# Altium project MB1219.PrjPCB (part 3 of 3)

## Sheet MCU.SchDoc: MCU
size A3; DocumentNumber: MB1219; Revision: B.1; SheetNumber: 2; SheetTotal: 17; Project: STM32F769I-EVAL
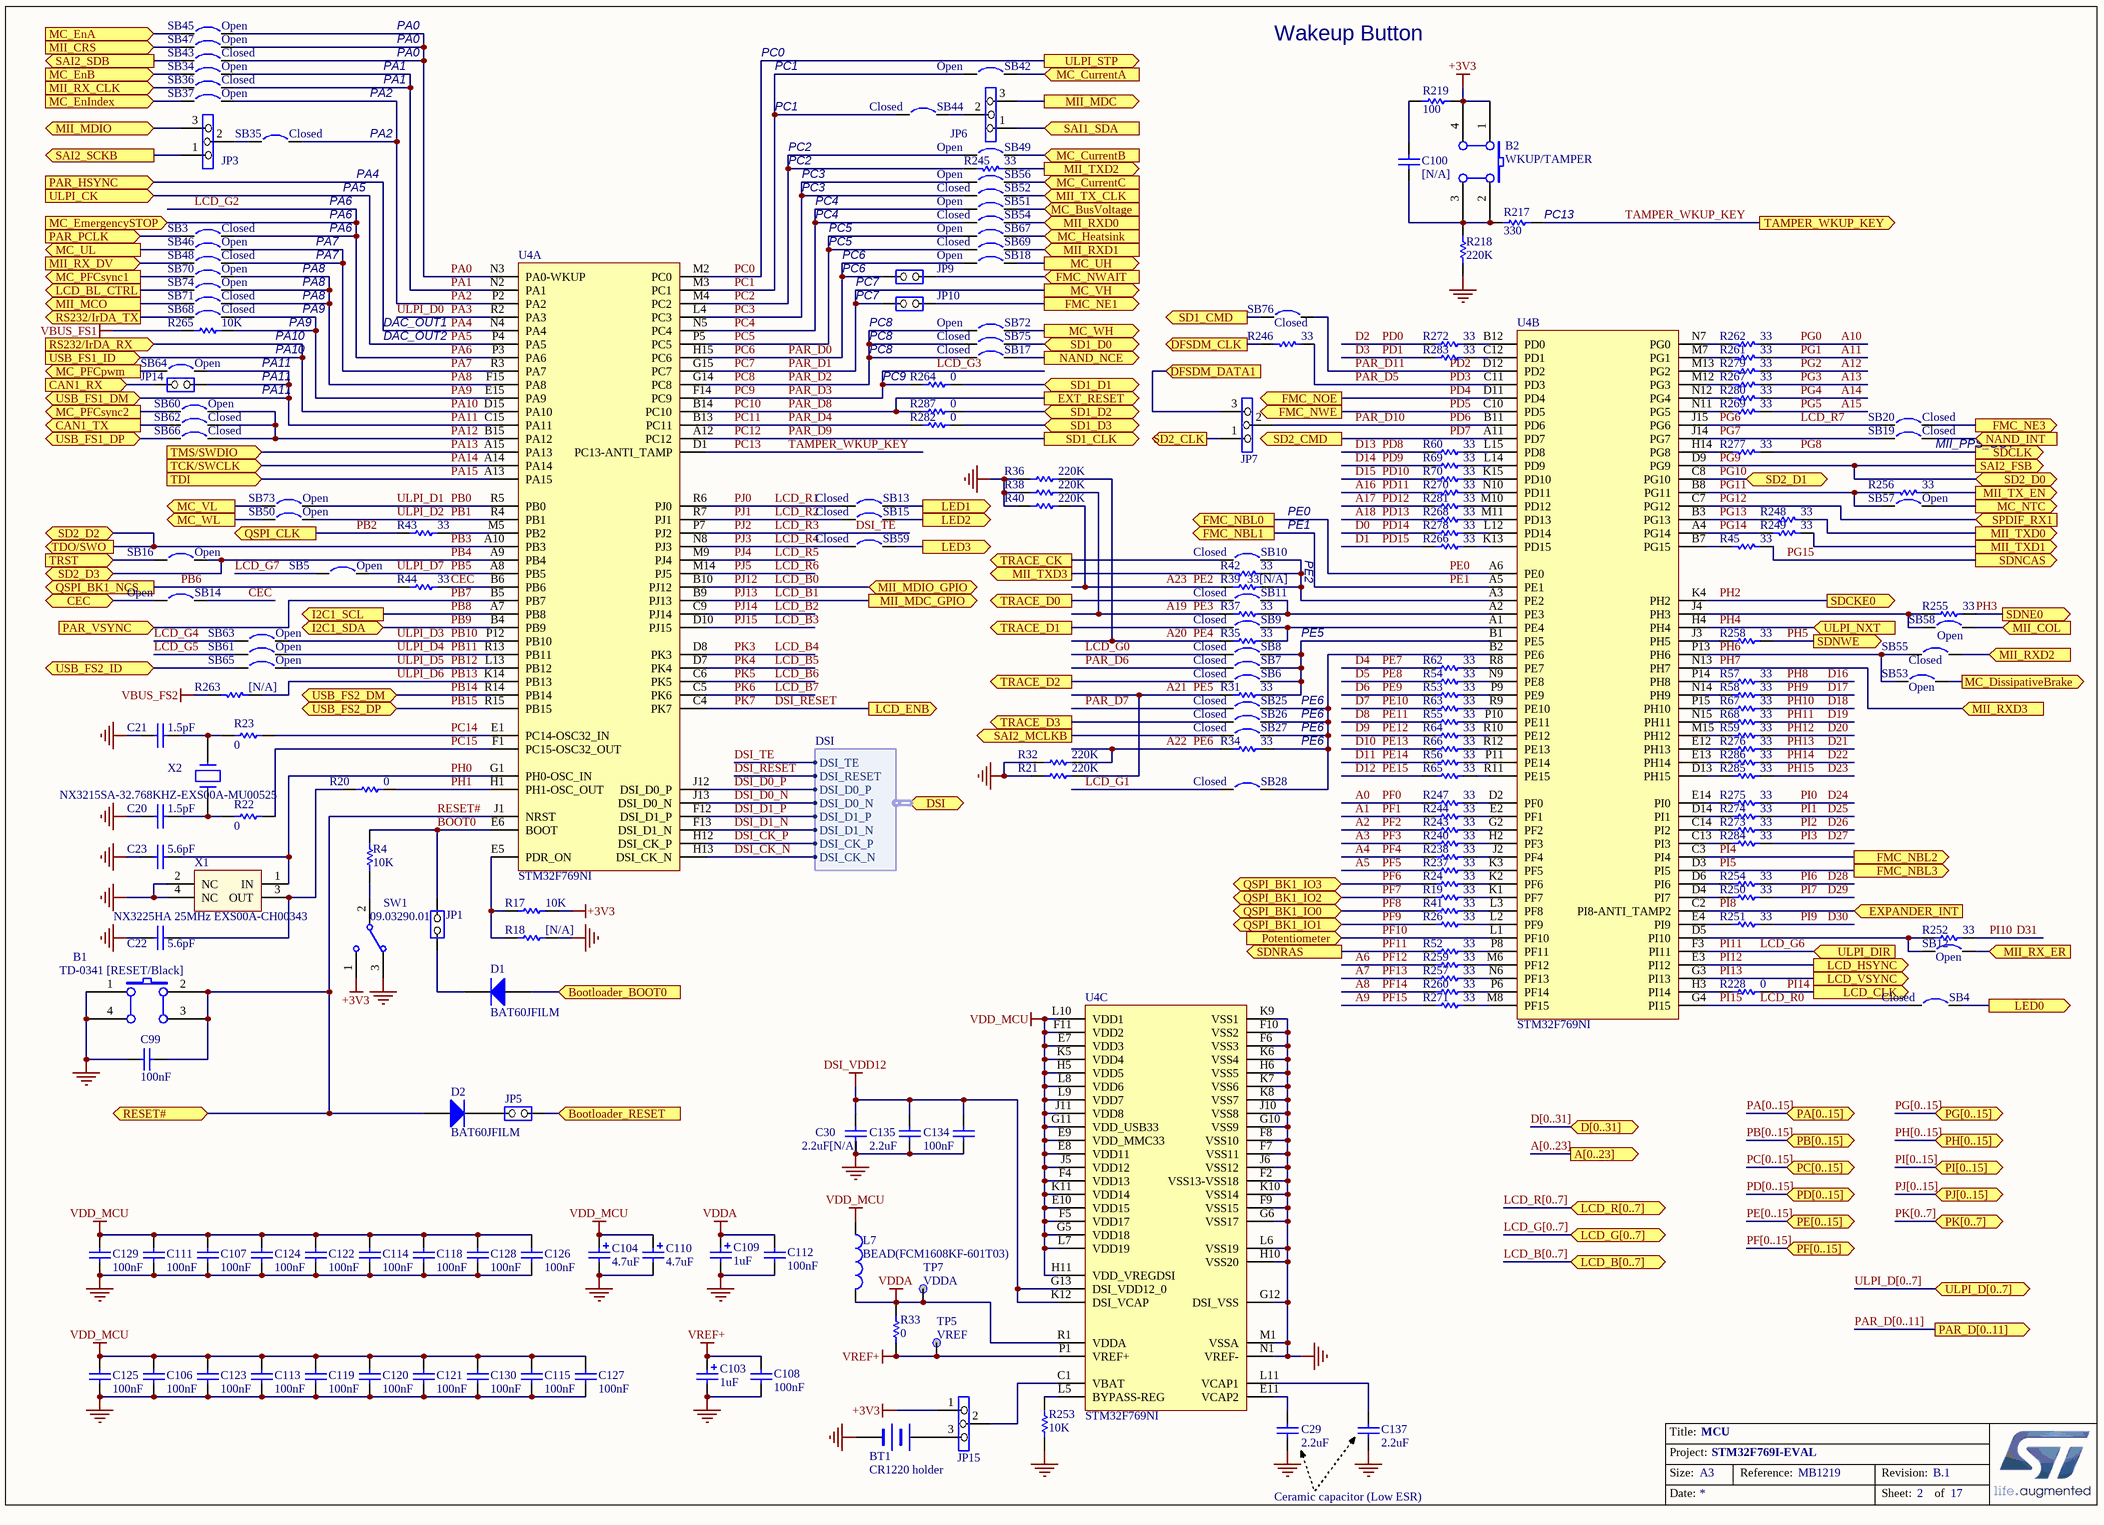
[diagram p16: MCU.SchDoc]

### Parts
B1  TD-0341 [RESET/Black]  [PB10]
B2  WKUP/TAMPER  [PB10]
BT1  CR1220 holder  [BAT_2SM_CR1220]
C20  1.5pF  [0402C]
C21  1.5pF  [0402C]
C22  5.6pF  [0603C]
C23  5.6pF  [0603C]
C29  2.2uF  [1206C]
C30  2.2uF[N/A]  [1206C]
C99  100nF  [0603C]
C100  [N/A]  [0603C]
C103  1uF  [TAN-A]
C104  4.7uF  [TAN-A]
C106  100nF  [0402C]
C107  100nF  [0402C]
C108  100nF  [0402C]
C109  1uF  [TAN-A]
C110  4.7uF  [TAN-A]
C111  100nF  [0402C]
C112  100nF  [0402C]
C113  100nF  [0402C]
C114  100nF  [0402C]
C115  100nF  [0402C]
C118  100nF  [0402C]
C119  100nF  [0402C]
C120  100nF  [0402C]
C121  100nF  [0402C]
C122  100nF  [0402C]
C123  100nF  [0402C]
C124  100nF  [0402C]
C125  100nF  [0402C]
C126  100nF  [0402C]
C127  100nF  [0402C]
C128  100nF  [0402C]
C129  100nF  [0402C]
C130  100nF  [0402C]
C134  100nF  [0402C]
C135  2.2uF  [0402C]
C137  2.2uF  [1206C]
D1  BAT60JFILM  [SOD-323]
D2  BAT60JFILM  [SOD-323]
JP1  (no value)  [SIP2]
JP3  (no value)  [SIP3]
JP5  (no value)  [SIP2]
JP6  (no value)  [SIP3]
JP7  (no value)  [SIP3]
JP9  (no value)  [SIP2]
JP10  (no value)  [SIP2]
JP14  (no value)  [SIP2]
JP15  (no value)  [SIP3]
L7  BEAD(FCM1608KF-601T03)  [0603L]
R4  10K  [0603R]
R17  10K  [0603R]
R18  [N/A]  [0603R]
R19  33  [0402R]
R20  0  [0603R]
R21  220K  [0603R]
R22  0  [0402R]
R23  0  [0402R]
R24  33  [0402R]
R26  33  [0402R]
R31  33  [0402R]
R32  220K  [0603R]
R33  0  [0603R]
R34  33  [0402R]
R35  33  [0402R]
R36  220K  [0603R]
R37  33  [0402R]
R38  220K  [0603R]
R39  33[N/A]  [0402R]
R40  220K  [0603R]
R41  33  [0402R]
R42  33  [0603R]
R43  33  [0402R]
R44  33  [0402R]
R45  33  [0402R]
R52  33  [0402R]
R53  33  [0402R]
R54  33  [0402R]
R55  33  [0402R]
R56  33  [0402R]
R57  33  [0402R]
R58  33  [0402R]
R59  33  [0402R]
R60  33  [0402R]
R62  33  [0402R]
R63  33  [0402R]
R64  33  [0402R]
R65  33  [0402R]
R66  33  [0402R]
R67  33  [0402R]
R68  33  [0402R]
R69  33  [0402R]
R70  33  [0402R]
R217  330  [0603R]
R218  220K  [0603R]
R219  100  [0603R]
R228  0  [0603R]
R237  33  [0402R]
R238  33  [0402R]
R240  33  [0402R]
R243  33  [0402R]
R244  33  [0402R]
R245  33  [0603R]
R246  33  [0603R]
R247  33  [0402R]
R248  33  [0603R]
R249  33  [0603R]
R250  33  [0402R]
R251  33  [0402R]
R252  33  [0402R]
R253  10K  [0603R]
R254  33  [0402R]
R255  33  [0402R]
R256  33  [0603R]
R257  33  [0402R]
R258  33  [0402R]
R259  33  [0402R]
R260  33  [0402R]
R261  33  [0402R]
R262  33  [0402R]
R263  [N/A]  [0603R]
R264  0  [0603R]
R265  10K  [0603R]
R266  33  [0402R]
R267  33  [0402R]
R268  33  [0402R]
R269  33  [0402R]
R270  33  [0402R]
R271  33  [0402R]
R272  33  [0402R]
R273  33  [0402R]
R274  33  [0402R]
R275  33  [0402R]
R276  33  [0402R]
R277  33  [0402R]
R278  33  [0402R]
R279  33  [0402R]
R280  33  [0402R]
R281  33  [0402R]
R282  0  [0603R]
R283  33  [0402R]
R284  33  [0402R]
R285  33  [0402R]
R286  33  [0402R]
R287  0  [0603R]
SB3  Closed  [SB_0603]
SB4  Closed  [SB_0603]
SB5  Open  [SB_0603]
SB6  Closed  [SB_0603]
SB7  Closed  [SB_0603]
SB8  Closed  [SB_0603]
SB9  Closed  [SB_0603]
SB10  Closed  [SB_0603]
SB11  Closed  [SB_0603]
SB12  Open  [SB_0603]
SB13  Closed  [SB_0603]
SB14  Open  [SB_0603]
SB15  Closed  [SB_0603]
SB16  Open  [SB_0603]
SB17  Closed  [SB_0603]
SB18  Open  [SB_0603]
SB19  Closed  [SB_0603]
SB20  Closed  [SB_0603]
SB25  Closed  [SB_0603]
SB26  Closed  [SB_0603]
SB27  Closed  [SB_0603]
SB28  Closed  [SB_0603]
SB34  Open  [SB_0603]
SB35  Closed  [SB_0603]
SB36  Closed  [SB_0603]
SB37  Open  [SB_0603]
SB42  Open  [SB_0603]
SB43  Closed  [SB_0603]
SB44  Closed  [SB_0603]
SB45  Open  [SB_0603]
SB46  Open  [SB_0603]
SB47  Open  [SB_0603]
SB48  Closed  [SB_0603]
SB49  Open  [SB_0603]
SB50  Open  [SB_0603]
SB51  Open  [SB_0603]
SB52  Closed  [SB_0603]
SB53  Open  [SB_0603]
SB54  Closed  [SB_0603]
SB55  Closed  [SB_0603]
SB56  Open  [SB_0603]
SB57  Open  [SB_0603]
SB58  Open  [SB_0603]
SB59  Closed  [SB_0603]
SB60  Open  [SB_0603]
SB61  Open  [SB_0603]
SB62  Closed  [SB_0603]
SB63  Open  [SB_0603]
SB64  Open  [SB_0603]
SB65  Open  [SB_0603]
SB66  Closed  [SB_0603]
SB67  Open  [SB_0603]
SB68  Closed  [SB_0603]
SB69  Closed  [SB_0603]
SB70  Open  [SB_0603]
SB71  Closed  [SB_0603]
SB72  Open  [SB_0603]
SB73  Open  [SB_0603]
SB74  Open  [SB_0603]
SB75  Closed  [SB_0603]
SB76  Closed  [SB_0603]
SW1  09.03290.01  [SW1_3TH_2R54_10X2R5]
TP5  VREF  [TP]
TP7  VDDA  [TP]
U4  STM32F769NI  [BGA216_0R8_13X13_SKT]  (parts A,B,C of 3)
X1  NX3225HA 25MHz EXS00A-CH00343  [XTAL_4SM_3R2X2R5]
X2  NX3215SA-32.768KHZ-EXS00A-MU00525  [XTAL_2SM_3R2X1R5]

### Ports
A[0..23] (out), Bootloader_BOOT0 (in), Bootloader_RESET (in), CAN1_RX (in), CAN1_TX (out), CEC (bidir), D[0..31] (bidir), DFSDM_CLK (out), DFSDM_DATA1 (in), DSI (harness DSI), EXPANDER_INT (in), EXT_RESET (out), FMC_NBL0 (out), FMC_NBL1 (out), FMC_NBL2 (out), FMC_NBL3 (out), FMC_NE1 (out), FMC_NE3 (out), FMC_NOE (out), FMC_NWAIT (in), FMC_NWE (out), I2C1_SCL (out), I2C1_SDA (bidir), LCD_B[0..7] (bidir), LCD_BL_CTRL (out), LCD_CLK (out), LCD_ENB (out), LCD_G[0..7] (bidir), LCD_HSYNC (out), LCD_R[0..7] (bidir), LCD_VSYNC (out), LED0 (out), LED1 (out), LED2 (out), LED3 (out), MC_BusVoltage (in), MC_CurrentA (in), MC_CurrentB (in), MC_CurrentC (in), MC_DissipativeBrake (out), MC_EmergencySTOP (in), MC_EnA (in), MC_EnB (in), MC_EnIndex (in), MC_Heatsink (in), MC_NTC (out), MC_PFCpwm (out), MC_PFCsync1 (out), MC_PFCsync2 (out), MC_UH (out), MC_UL (out), MC_VH (out), MC_VL (out), MC_WH (out), MC_WL (out), MII_COL (in), MII_CRS (in), MII_MCO (out), MII_MDC (out), MII_MDC_GPIO (out), MII_MDIO (bidir), MII_MDIO_GPIO (bidir), MII_RX_CLK (in), MII_RX_DV (in), MII_RX_ER (in), MII_RXD0 (in), MII_RXD1 (in), MII_RXD2 (in), MII_RXD3 (in), MII_TX_CLK (in), MII_TX_EN (out), MII_TXD0 (out), MII_TXD1 (out), MII_TXD2 (out), MII_TXD3 (out), NAND_INT (in), NAND_NCE (out), PA[0..15] (bidir), PAR_D[0..11] (out), PAR_HSYNC (in), PAR_PCLK (in), PAR_VSYNC (in), PB[0..15] (bidir), PC[0..15] (bidir), PD[0..15] (bidir), PE[0..15] (bidir), PF[0..15] (bidir), PG[0..15] (bidir), PH[0..15] (bidir), PI[0..15] (bidir), PJ[0..15] (bidir), PK[0..7] (bidir), Potentiometer (in), QSPI_BK1_IO0 (bidir), QSPI_BK1_IO1 (bidir), QSPI_BK1_IO2 (bidir), QSPI_BK1_IO3 (bidir), QSPI_BK1_NCS (out), QSPI_CLK (out), RESET# (bidir), RS232/IrDA_RX (in), RS232/IrDA_TX (out), SAI1_SDA (in), SAI2_FSB (out), SAI2_MCLKB (out), SAI2_SCKB (out), SAI2_SDB (out), SD1_CLK (out), SD1_CMD (out), SD1_D0 (bidir), SD1_D1 (bidir), SD1_D2 (bidir), SD1_D3 (bidir), SD2_CLK (out), SD2_CMD (out), SD2_D0 (bidir), SD2_D1 (bidir), SD2_D2 (bidir), SD2_D3 (bidir), SDCKE0 (out), SDCLK (out), SDNCAS (out), SDNE0 (out), SDNRAS (out), SDNWE (out), SPDIF_RX1 (in), TAMPER_WKUP_KEY (out), TCK/SWCLK (in), TDI (in), TDO/SWO (out), TMS/SWDIO (in), TRACE_CK (out), TRACE_D0 (out), TRACE_D1 (out), TRACE_D2 (out), TRACE_D3 (out), TRST (in), ULPI_CK (in), ULPI_D[0..7] (bidir), ULPI_DIR (in), ULPI_NXT (in), ULPI_STP (out), USB_FS1_DM (bidir), USB_FS1_DP (bidir), USB_FS1_ID (in), USB_FS2_DM (bidir), USB_FS2_DP (bidir), USB_FS2_ID (bidir)

### Harnesses
DSI: DSI_CK_P, DSI_CK_N, DSI_D0_P, DSI_D0_N, DSI_D1_P, DSI_D1_N, DSI_TE, DSI_RESET

### Nets
+3V3: B2.1(A0) B2.4(A1) JP15.1 R17.2 R219.1 SW1.1
DSI_VDD12: C30.1 C134.1 C135.1 U4.G13(DSI_VDD12_0) U4.K12(DSI_VCAP)
GND: B1.1(A0) B1.4(A1) BT1.2(-) C20.2 C21.2 C22.2 C23.2 C29.2 C30.2 C99.1 C103.2 C104.2 C106.2 C107.2 C108.1 C109.2 C110.2 C111.2 C112.1 C113.2 C114.2 C115.2 C118.2 C119.2 C120.2 C121.2 C122.2 C123.2 C124.2 C125.2 C126.2 C127.2 C128.2 C129.2 C130.2 C134.2 C135.2 C137.2 R18.2 R21.1 R32.1 R36.1 R38.1 R40.1 R218.2 R253.1 SW1.3 U4.F2(VSS13-VSS18) U4.F6(VSS3) U4.F7(VSS11) U4.F8(VSS10) U4.F9(VSS15) U4.F10(VSS2) U4.G6(VSS17) U4.G10(VSS9) U4.G12(DSI_VSS) U4.H6(VSS5) U4.H10(VSS20) U4.J6(VSS12) U4.J10(VSS8) U4.K6(VSS4) U4.K7(VSS6) U4.K8(VSS7) U4.K9(VSS1) U4.K10(VSS14) U4.L6(VSS19) U4.M1(VSSA) U4.N1(VREF-) X1.2(NC) X1.4(NC)
VBUS_FS1: R265.2
VBUS_FS2: R263.1
VDD_MCU: C104.1 C106.1 C107.1 C110.1 C111.1 C113.1 C114.1 C115.1 C118.1 C119.1 C120.1 C121.1 C122.1 C123.1 C124.1 C125.1 C126.1 C127.1 C128.1 C129.1 C130.1 L7.1 U4.E7(VDD3) U4.E8(VDD11) U4.E9(VDD_MMC33) U4.E10(VDD15) U4.F4(VDD13) U4.F5(VDD17) U4.F11(VDD2) U4.G5(VDD18) U4.G11(VDD_USB33) U4.H5(VDD5) U4.H11(VDD_VREGDSI) U4.J5(VDD12) U4.J11(VDD8) U4.K5(VDD4) U4.K11(VDD14) U4.L7(VDD19) U4.L8(VDD6) U4.L9(VDD7) U4.L10(VDD1)
VDDA: C109.1 C112.2 L7.2 R33.1 TP7.1 U4.R1(VDDA)
VREF+: C103.1 C108.2 R33.2 TP5.1 U4.P1(VREF+)
A0: R247.2  [also labelled PF0]
A1: R244.2  [also labelled PF1]
A2: R243.2  [also labelled PF2]
A3: R240.2  [also labelled PF3]
A4: R238.2  [also labelled PF4]
A5: R237.2  [also labelled PF5]
A6: R259.2  [also labelled PF12]
A7: R257.2  [also labelled PF13]
A8: R260.2  [also labelled PF14]
A9: R271.2  [also labelled PF15]
A10: R262.2  [also labelled PG0]
A11: R261.2  [also labelled PG1]
A12: R279.2  [also labelled PG2]
A13: R267.2  [also labelled PG3]
A14: R280.2  [also labelled PG4]
A15: R269.2  [also labelled PG5]
A16: R270.1  [also labelled PD11]
A17: R281.2  [also labelled PD12]
A18: R268.2  [also labelled PD13]
A19: R37.2 R38.2  [also labelled PE3]
A20: R35.2 R36.2  [also labelled PE4]
A21: R21.2 R31.2  [also labelled PE5]
A22: R32.2 R34.2  [also labelled PE6]
A23: R39.2 R40.2  [also labelled PE2]
BOOT0: JP1.2(NO) R4.1 U4.E6(BOOT)
CEC: R44.1 SB14.2 U4.B6(PB6)
D0: R278.2  [also labelled PD14]
D1: R266.2  [also labelled PD15]
D2: R272.2  [also labelled PD0]
D2_P: SB66.1 ; port USB_FS1_DP
D3: R283.2  [also labelled PD1]
D4: R62.2  [also labelled PE7]
D5: R54.2  [also labelled PE8]
D6: R53.2  [also labelled PE9]
D7: R63.2  [also labelled PE10]
D8: R55.2  [also labelled PE11]
D9: R64.2  [also labelled PE12]
D10: R66.2  [also labelled PE13]
D11: R56.2  [also labelled PE14]
D12: R65.2  [also labelled PE15]
D13: R60.2  [also labelled PD8]
D14: R69.2  [also labelled PD9]
D15: R70.2  [also labelled PD10]
D16: R57.1  [also labelled PH8]
D17: R58.1  [also labelled PH9]
D18: R67.1  [also labelled PH10]
D19: R68.1  [also labelled PH11]
D20: R59.1  [also labelled PH12]
D21: R276.1  [also labelled PH13]
D22: R286.1  [also labelled PH14]
D23: R285.1  [also labelled PH15]
D24: R275.1  [also labelled PI0]
D25: R274.1  [also labelled PI1]
D26: R273.1  [also labelled PI2]
D27: R284.1  [also labelled PI3]
D28: R254.1  [also labelled PI6]
D29: R250.1  [also labelled PI7]
D30: R251.1  [also labelled PI9]
D31: R252.1  [also labelled PI10]
DSI_CK_N: U4.H13(DSI_CK_N) ; port DSI.DSI_CK_N
DSI_CK_P: U4.H12(DSI_CK_P) ; port DSI.DSI_CK_P
DSI_D0_N: U4.J13(DSI_D0_N) ; port DSI.DSI_D0_N
DSI_D0_P: U4.J12(DSI_D0_P) ; port DSI.DSI_D0_P
DSI_D1_N: U4.F13(DSI_D1_N) ; port DSI.DSI_D1_N
DSI_D1_P: U4.F12(DSI_D1_P) ; port DSI.DSI_D1_P
DSI_RESET: U4.C4(PK7) ; port LCD_ENB, port DSI.DSI_RESET  [also labelled PK7]
DSI_TE: U4.P7(PJ2) ; port DSI.DSI_TE  [also labelled LCD_R3, PJ2]
LCD_B0: U4.B10(PJ12) ; port MII_MDIO_GPIO  [also labelled PJ12]
LCD_B1: U4.B9(PJ13) ; port MII_MDC_GPIO  [also labelled PJ13]
LCD_B2: U4.C9(PJ14)  [also labelled PJ14]
LCD_B3: U4.D10(PJ15)  [also labelled PJ15]
LCD_B4: U4.D8(PK3)  [also labelled PK3]
LCD_B5: U4.D7(PK4)  [also labelled PK4]
LCD_B6: U4.C6(PK5)  [also labelled PK5]
LCD_B7: U4.C5(PK6)  [also labelled PK6]
LCD_BL_CTRL: SB74.1 ; port LCD_BL_CTRL
LCD_G0: SB8.1
LCD_G1: SB28.1
LCD_G2: SB3.2 U4.P3(PA6) ; port MC_EmergencySTOP  [also labelled PA6]
LCD_G3: R264.2 U4.F14(PC9)  [also labelled PAR_D3, PC9]
LCD_G4: SB63.1
LCD_G5: SB61.1
LCD_G6: U4.F3(PI11) ; port ULPI_DIR  [also labelled PI11]
LCD_G7: SB5.1
LCD_R0: SB4.1 U4.G4(PI15)  [also labelled PI15]
LCD_R1: SB13.1 U4.R6(PJ0)  [also labelled PJ0]
LCD_R2: SB15.1 U4.R7(PJ1)  [also labelled PJ1]
LCD_R4: SB59.1 U4.N8(PJ3)  [also labelled PJ3]
LCD_R5: U4.M9(PJ4)  [also labelled PJ4]
LCD_R6: U4.M14(PJ5)  [also labelled PJ5]
LCD_R7: SB20.1 U4.J15(PG6)  [also labelled PG6]
PA0: SB43.2 SB45.2 SB47.2 U4.N3(PA0-WKUP)
PA1: SB34.2 SB36.2 U4.N2(PA1)
PA2: SB35.2 SB37.2 U4.P2(PA2)
PA3: U4.R2(PA3)  [also labelled ULPI_D0]
PA4: U4.N4(PA4) ; port PAR_HSYNC
PA5: U4.P4(PA5) ; port ULPI_CK
PA7: SB46.2 SB48.2 U4.R3(PA7)
PA8: SB70.2 SB71.2 SB74.2 U4.F15(PA8)
PA9: R265.1 SB68.2 U4.E15(PA9)
PA10: U4.D15(PA10) ; port RS232/IrDA_RX, port USB_FS1_ID
PA11: JP14.1(COMMON) SB64.2 U4.C15(PA11) ; port USB_FS1_DM  [project net D2_N]
PA12: SB60.2 SB62.2 SB66.2 U4.B15(PA12)
PA13: U4.A15(PA13) ; port TMS/SWDIO
PA14: U4.A14(PA14) ; port TCK/SWCLK
PA15: U4.A13(PA15) ; port TDI
PAR_D0: JP9.1(COMMON) SB18.1 U4.H15(PC6)  [also labelled PC6]
PAR_D1: JP10.1(COMMON) U4.G15(PC7) ; port MC_VH  [also labelled PC7]
PAR_D2: SB17.1 SB72.1 SB75.1 U4.G14(PC8)  [also labelled PC8]
PAR_D4: R282.2 U4.B13(PC11)  [also labelled PC11]
PAR_D5: R246.2 U4.C11(PD3)  [also labelled PD3]
PAR_D6: SB7.1
PAR_D7: SB25.1
PAR_D8: R287.2 U4.B14(PC10) ; port EXT_RESET  [also labelled PC10]
PAR_D9: U4.A12(PC12) ; port SD1_CLK  [also labelled PC12]
PAR_D10: JP7.2 U4.B11(PD6)  [also labelled PD6]
PAR_D11: SB76.2 U4.D12(PD2)  [also labelled PD2]
PB0: SB73.2 U4.R5(PB0)  [also labelled ULPI_D1]
PB1: SB50.2 U4.R4(PB1)  [also labelled ULPI_D2]
PB2: R43.2 ; port QSPI_CLK
PB3: U4.A10(PB3) ; port TDO/SWO, port SD2_D2
PB4: SB16.2 U4.A9(PB4) ; port SD2_D3
PB5: SB5.2 U4.A8(PB5)  [also labelled ULPI_D7]
PB6: R44.2 ; port QSPI_BK1_NCS
PB7: U4.B5(PB7) ; port PAR_VSYNC
PB8: U4.A7(PB8) ; port I2C1_SCL  [project net I2C1_SCL]
PB9: U4.B4(PB9) ; port I2C1_SDA  [project net I2C1_SDA]
PB10: SB63.2 U4.P12(PB10)  [also labelled ULPI_D3]
PB11: SB61.2 U4.R13(PB11)  [also labelled ULPI_D4]
PB12: SB65.2 U4.L13(PB12)  [also labelled ULPI_D5]
PB13: R263.2 U4.K14(PB13)  [also labelled ULPI_D6]
PB14: U4.R14(PB14) ; port USB_FS2_DM  [project net D1_N]
PB15: U4.R15(PB15) ; port USB_FS2_DP  [project net D1_P]
PC0: U4.M2(PC0) ; port ULPI_STP
PC1: SB42.1 SB44.1 U4.M3(PC1)
PC2: R245.1 SB49.1 U4.M4(PC2)
PC3: SB52.1 SB56.1 U4.L4(PC3)
PC4: SB51.1 SB54.1 U4.N5(PC4)
PC5: SB67.1 SB69.1 U4.P5(PC5)
PC13: R217.2 U4.D1(PC13-ANTI_TAMP) ; port TAMPER_WKUP_KEY  [also labelled TAMPER_WKUP_KEY]
PC14: R23.2 U4.E1(PC14-OSC32_IN)
PC15: R22.2 U4.F1(PC15-OSC32_OUT)
PD4: U4.D11(PD4) ; port FMC_NOE
PD5: U4.C10(PD5) ; port FMC_NWE
PD7: U4.A11(PD7) ; port SD2_CMD
PE0: U4.A6(PE0) ; port FMC_NBL0
PE1: U4.A5(PE1) ; port FMC_NBL1
PF6: R24.2 ; port QSPI_BK1_IO3
PF7: R19.2 ; port QSPI_BK1_IO2
PF8: R41.2 ; port QSPI_BK1_IO0
PF9: R26.2 ; port QSPI_BK1_IO1
PF10: U4.L1(PF10) ; port Potentiometer
PF11: R52.2 ; port SDNRAS
PG7: SB19.1 U4.J14(PG7)
PG8: R277.2 ; port SDCLK
PG9: U4.D9(PG9) ; port SAI2_FSB, port SD2_D0
PG10: U4.C8(PG10) ; port SD2_D1
PG11: R256.1 SB57.1 U4.B8(PG11)
PG12: U4.C7(PG12) ; port SPDIF_RX1
PG13: R248.1 U4.B3(PG13)
PG14: R249.1 U4.A4(PG14)
PG15: R45.2 ; port SDNCAS
PH0: C23.1 U4.G1(PH0-OSC_IN) X1.1(IN)
PH1: R20.1 U4.H1(PH1-OSC_OUT)
PH2: U4.K4(PH2) ; port SDCKE0
PH3: R255.1 ; port SDNE0
PH4: U4.H4(PH4) ; port ULPI_NXT
PH5: R258.1 ; port SDNWE
PH6: SB53.1 SB55.1 U4.P13(PH6)
PH7: U4.N13(PH7) ; port MII_RXD3
PI4: U4.C3(PI4) ; port FMC_NBL2
PI5: U4.D3(PI5) ; port FMC_NBL3
PI8: U4.C2(PI8-ANTI_TAMP2) ; port EXPANDER_INT
PI12: U4.E3(PI12) ; port LCD_HSYNC
PI13: U4.G3(PI13) ; port LCD_VSYNC
PI14: R228.1 ; port LCD_CLK
RESET#: B1.2(B0) B1.3(B1) C99.2 D2.1(A) U4.J1(NRST) ; port RESET#
T_JRST: SB16.1 ; port TRST
NetB2_2: B2.2(B0) B2.3(B1) C100.2 R217.1 R218.1
NetBT1_1: BT1.1(+) JP15.3
NetC6_2: SB45.1 ; port MC_EnA
NetC7_2: SB60.1 ; port MC_PFCsync2
NetC8_2: SB34.1 ; port MC_EnB
NetC9_2: SB37.1 ; port MC_EnIndex
NetC10_2: SB64.1 ; port MC_PFCpwm
NetC11_1: SB67.2 ; port MC_Heatsink
NetC12_2: SB56.2 ; port MC_CurrentC
NetC13_2: SB49.2 ; port MC_CurrentB
NetC14_2: SB42.2 ; port MC_CurrentA
NetC15_1: SB51.2 ; port MC_BusVoltage
NetC18_2: SB70.1 ; port MC_PFCsync1
NetC20_1: C20.1 R22.1 X2.1
NetC21_1: C21.1 R23.1 X2.2
NetC22_1: C22.1 R20.2 X1.3(OUT)
NetC29_1: C29.1 U4.E11(VCAP2)
NetC100_1: C100.1 R219.2
NetC137_1: C137.1 U4.L11(VCAP1)
NetCN1_3: SB18.2 ; port MC_UH
NetCN1_5: SB46.1 ; port MC_UL
NetCN1_9: SB73.1 ; port MC_VL
NetCN1_11: SB72.2 ; port MC_WH
NetCN1_13: SB50.1 ; port MC_WL
NetCN1_21: SB57.2 ; port MC_NTC
NetCN1_23: SB53.2 ; port MC_DissipativeBrake
NetCN4_33: SB3.1 ; port PAR_PCLK
NetCN11_6: JP9.2(NO) ; port FMC_NWAIT
NetCN12_12: SB10.1 ; port TRACE_CK
NetCN12_14: SB11.1 ; port TRACE_D0
NetCN12_16: SB9.1 ; port TRACE_D1
NetCN12_18: SB6.1 ; port TRACE_D2
NetCN12_20: SB26.1 ; port TRACE_D3
NetCN14_4: SB65.1 ; port USB_FS2_ID
NetCN15_35: JP3.1 ; port SAI2_SCKB
NetCN15_39: SB43.1 ; port SAI2_SDB
NetCN15_45: SB71.1 ; port MII_MCO
NetCN15_47: SB14.1 ; port CEC
NetCN17_1: R287.1 ; port SD1_D2
NetCN17_2: R282.1 ; port SD1_D3
NetCN17_3: SB76.1 ; port SD1_CMD
NetCN17_7: SB75.2 ; port SD1_D0
NetCN17_8: R264.1 ; port SD1_D1
NetCN30_5: JP7.1 ; port SD2_CLK
NetD1_1: D1.1(A) ; port Bootloader_BOOT0
NetD1_2: D1.2(K) JP1.1(COMMON)
NetD2_2: D2.2(K) JP5.1(COMMON)
NetJP3_2: JP3.2 SB35.1
NetJP3_3: JP3.3 ; port MII_MDIO
NetJP5_2: JP5.2(NO) ; port Bootloader_RESET
NetJP6_1: JP6.1 ; port SAI1_SDA
NetJP6_2: JP6.2 SB44.2
NetJP6_3: JP6.3 ; port MII_MDC
NetJP7_3: JP7.3 ; port DFSDM_DATA1
NetJP10_2: JP10.2(NO) ; port FMC_NE1
NetJP13_3: SB19.2 ; port NAND_INT
NetJP14_2: JP14.2(NO) ; port CAN1_RX
NetJP15_2: JP15.2 U4.C1(VBAT)
NetJP17_3: SB17.2 ; port NAND_NCE
NetJP24_3: R246.1 ; port DFSDM_CLK
NetJP26_2: SB68.1 ; port RS232/IrDA_TX
NetR4_2: R4.2 SW1.2
NetR17_1: R17.1 R18.1 U4.E5(PDR_ON)
NetR19_1: R19.1 U4.K1(PF7)
NetR24_1: R24.1 U4.K2(PF6)
NetR26_1: R26.1 U4.L2(PF9)
NetR31_1: R31.1 SB6.2 SB7.2 SB8.2 U4.B1(PE5)
NetR34_1: R34.1 SB25.2 SB26.2 SB27.2 SB28.2 U4.B2(PE6)
NetR35_1: R35.1 SB9.2 U4.A1(PE4)
NetR37_1: R37.1 SB11.2 U4.A2(PE3)
NetR39_1: R39.1 R42.2 SB10.2 U4.A3(PE2)
NetR41_1: R41.1 U4.L3(PF8)
NetR42_1: R42.1 ; port MII_TXD3
NetR43_1: R43.1 U4.M5(PB2)
NetR45_1: R45.1 U4.B7(PG15)
NetR47_2: SB55.2 ; port MII_RXD2
NetR48_2: SB69.2 ; port MII_RXD1
NetR49_2: SB54.2 ; port MII_RXD0
NetR50_2: SB48.1 ; port MII_RX_DV
NetR51_2: SB36.1 ; port MII_RX_CLK
NetR52_1: R52.1 U4.P8(PF11)
NetR53_1: R53.1 U4.P9(PE9)
NetR54_1: R54.1 U4.N9(PE8)
NetR55_1: R55.1 U4.P10(PE11)
NetR56_1: R56.1 U4.P11(PE14)
NetR57_2: R57.2 U4.P14(PH8)
NetR58_2: R58.2 U4.N14(PH9)
NetR59_2: R59.2 U4.M15(PH12)
NetR60_1: R60.1 U4.L15(PD8)
NetR61_2: SB52.2 ; port MII_TX_CLK
NetR62_1: R62.1 U4.R8(PE7)
NetR63_1: R63.1 U4.R9(PE10)
NetR64_1: R64.1 U4.R10(PE12)
NetR65_1: R65.1 U4.R11(PE15)
NetR66_1: R66.1 U4.R12(PE13)
NetR67_2: R67.2 U4.P15(PH10)
NetR68_2: R68.2 U4.N15(PH11)
NetR69_1: R69.1 U4.L14(PD9)
NetR70_1: R70.1 U4.K15(PD10)
NetR146_2: SB20.2 ; port FMC_NE3
NetR213_1: SB59.2 ; port LED3
NetR214_1: SB15.2 ; port LED2
NetR215_1: SB13.2 ; port LED1
NetR216_1: SB4.2 ; port LED0
NetR228_2: R228.2 U4.H3(PI14)
NetR237_1: R237.1 U4.K3(PF5)
NetR238_1: R238.1 U4.J2(PF4)
NetR240_1: R240.1 U4.H2(PF3)
NetR243_1: R243.1 U4.G2(PF2)
NetR244_1: R244.1 U4.E2(PF1)
NetR245_2: R245.2 ; port MII_TXD2
NetR247_1: R247.1 U4.D2(PF0)
NetR248_2: R248.2 ; port MII_TXD0
NetR249_2: R249.2 ; port MII_TXD1
NetR250_2: R250.2 U4.D4(PI7)
NetR251_2: R251.2 U4.E4(PI9)
NetR252_2: R252.2 SB12.1 U4.D5(PI10)
NetR253_2: R253.2 U4.L5(BYPASS-REG)
NetR254_2: R254.2 U4.D6(PI6)
NetR255_2: R255.2 SB58.1 U4.J4(PH3)
NetR256_2: R256.2 ; port MII_TX_EN
NetR257_1: R257.1 U4.N6(PF13)
NetR258_2: R258.2 U4.J3(PH5)
NetR259_1: R259.1 U4.M6(PF12)
NetR260_1: R260.1 U4.P6(PF14)
NetR261_1: R261.1 U4.M7(PG1)
NetR262_1: R262.1 U4.N7(PG0)
NetR266_1: R266.1 U4.K13(PD15)
NetR267_1: R267.1 U4.M12(PG3)
NetR268_1: R268.1 U4.M11(PD13)
NetR269_1: R269.1 U4.N11(PG5)
NetR270_2: R270.2 U4.N10(PD11)
NetR271_1: R271.1 U4.M8(PF15)
NetR272_1: R272.1 U4.B12(PD0)
NetR273_2: R273.2 U4.C14(PI2)
NetR274_2: R274.2 U4.D14(PI1)
NetR275_2: R275.2 U4.E14(PI0)
NetR276_2: R276.2 U4.E12(PH13)
NetR277_1: R277.1 U4.H14(PG8)
NetR278_1: R278.1 U4.L12(PD14)
NetR279_1: R279.1 U4.M13(PG2)
NetR280_1: R280.1 U4.N12(PG4)
NetR281_1: R281.1 U4.M10(PD12)
NetR283_1: R283.1 U4.C12(PD1)
NetR284_2: R284.2 U4.C13(PI3)
NetR285_2: R285.2 U4.D13(PH15)
NetR286_2: R286.2 U4.E13(PH14)
NetSB12_2: SB12.2 ; port MII_RX_ER
NetSB27_1: SB27.1 ; port SAI2_MCLKB
NetSB47_1: SB47.1 ; port MII_CRS
NetSB58_2: SB58.2 ; port MII_COL
NetSB62_1: SB62.1 ; port CAN1_TX

### Buses and harness runs
bus A[0..23] = port A[0..23]
bus D[0..31] = port D[0..31]
bus LCD_B[0..7] = port LCD_B[0..7]
bus LCD_G[0..7] = port LCD_G[0..7]
bus LCD_R[0..7] = port LCD_R[0..7]
bus PA[0..15] = port PA[0..15]
bus PAR_D[0..11] = port PAR_D[0..11]
bus PB[0..15] = port PB[0..15]
bus PC[0..15] = port PC[0..15]
bus PD[0..15] = port PD[0..15]
bus PE[0..15] = port PE[0..15]
bus PF[0..15] = port PF[0..15]
bus PG[0..15] = port PG[0..15]
bus PH[0..15] = port PH[0..15]
bus PI[0..15] = port PI[0..15]
bus PJ[0..15] = port PJ[0..15]
bus PK[0..7] = port PK[0..7]
bus ULPI_D[0..7] = port ULPI_D[0..7]

### Notes on the sheet
- PA0
- Wakeup Button
- PA2
- PA1
- PC0
- PC1
- PA4
- PC2
- PC3
- PA7
- PA6
- PA5
- PC4
- PC5
- (near R217) PC13
- PA8
- PA9
- PC6
- PC7
- PA11
- PA10
- DAC_OUT1
- DAC_OUT2
- (near JP10) PC8
- PC8
- PC9
- (near SB19) MII_PPS_OUT
- PE0
- PE1
- PE2
- PE5
- PE6
- Ceramic capacitor (Low ESR)
- Title:
- Project:
- Size:
- Date:
- A3
- Reference:
- Sheet:
- Revision:
- of

### Library data of the parts
B1 B2 = SW PUSHBUTTON: SE PUSHBUTTON
BT1 = BATTERY
C20-C23 C106 C107 C111 C113-C115 C118-C130 C134 = CAP: Capacitor
  C106 C107 C111 C113-C115 C118-C130 C134: Published: 8-Jun-2000; Revision: July-2002: Re-released for DXP Platform.; Publisher: Altium Limited; Value: 100nF
C29 C30 C108 C112 C137 = Cap: Capacitor; Value: 10nF; Published: 8-Jun-2000; Revision: July-2002: Re-released for DXP Platform.; Publisher: Altium Limited
C99 C100 = CAP: Capacitor; Value: 100pF; Published: 8-Jun-2000; Revision: July-2002: Re-released for DXP Platform.; Publisher: Altium Limited
C103 C109 = Cap Pol1: Polarized Capacitor (Radial); Value: 10uF; Published: 8-Jun-2000; Revision: July-2002: Re-released for DXP Platform.; Publisher: Altium Limited
C104 C110 = Cap Pol1: Polarized Capacitor (Radial); Value: 47uF; Published: 8-Jun-2000; Revision: July-2002: Re-released for DXP Platform.; Publisher: Altium Limited
C135 = CAP: Capacitor; Value: 100nF; Published: 8-Jun-2000; Revision: July-2002: Re-released for DXP Platform.; Publisher: Altium Limited
D1 D2 = Diode: Default Diode; Code - JEDEC: DO-214-AB; Published: 8-Jun-2000; Revision: July-2002: Re-released for DXP Platform.; Publisher: Altium Limited
JP1 JP5 JP14 = JP2
JP3 JP6 JP7 JP15 = Jumper3
JP9 JP10 = JP2: Ordered by: Subcon; Silkscreen: Pwr_ext
L7 = Inductor: Value: 100uH; Published: 8-Jun-2000; Revision: July-2002: Re-released for DXP Platform.; Publisher: Altium Limited
R4 R21 R32 R36 R38 R40 R218 R265 = res1: Resistor; Value: 1K; Published: 8-Jun-2000; Revision: July-2002: Re-released for DXP Platform.; Publisher: Altium Limited
R17-R20 R22-R24 R26 R31 R33-R35 R37 R39 R41-R45 R52-R60 R62-R70 R217 R219 R228 R237 R238 R240 R243-R264 R266-R287 = Res1: Resistor; Value: 1K; Published: 8-Jun-2000; Revision: July-2002: Re-released for DXP Platform.; Publisher: Altium Limited
SB3 SB4 SB6-SB11 SB13-SB15 SB17 SB19 SB20 SB25-SB28 SB35 SB36 SB43 SB44 SB48 SB52 SB54 SB55 SB59 SB62 SB66 SB68 SB69 SB71 SB75 SB76 = Circuit Breaker_close: Circuit Breaker; Published: 24-Mar-1999; Revision: July-2002: Re-released for DXP Platform.; Publisher: Altium Limited
SB5 SB12 SB16 SB18 SB34 SB37 SB42 SB45-SB47 SB49-SB51 SB53 SB56-SB58 SB60 SB61 SB63-SB65 SB67 SB70 SB72-SB74 = Circuit Breaker: Published: 24-Mar-1999; Revision: July-2002: Re-released for DXP Platform.; Publisher: Altium Limited
SW1 = SW-SPDT: SPDT Subminiature Toggle Switch, Right Angle Mounting, Vertical Actuation; Revision 1: Jul-2002: Re-released for DXP Platform.; Revision 2: 17-Dec-2003: Schematic revised, PCB Footprint replaced.; Published: 24-Mar-1999; Datasheet: Latest Revision: 05-Dec-2000; Publisher: Altium Limited
TP5 TP7 = TP
U4 = STM32F7_TFBGA216
X1 = NX3225HA 25MHz
X2 = CRYSTAL_32K: Crystal

## Nets that join several sheets
+1V8: Audio (6 pins), Power (C61.1 TP6.1 U19.2 U19.4), LCD&Camera&Connectors (10 pins)
+2V8: Power (5 pins), LCD&Camera&Connectors (8 pins)
+3V3: MB1219 (R160.1 R161.1), Audio (13 pins), CAN&QSPI (7 pins), Ethernet (23 pins), ExtensionConnector (CN5.48 CN6.48 CN11.40), JTAG&Trace (8 pins), Memory (45 pins), MotorControl (CN1.28 R13.2), Peripherals (21 pins), Power (7 pins), ST_LINK_V2-1 (R180.1), USB_OTG (15 pins), USB_OTG_FS (R116.2 R127.2 R131.1), RS232 (C132.1 U5.22 U5.26), LCD&Camera&Connectors (6 pins), MFX & LEDs (17 pins), MCU (6 pins)
+5V: ExtensionConnector (CN5.60 CN6.60), MotorControl (CN1.25), Power (11 pins), ST_LINK_V2-1 (D16.1), USB_OTG (U7.5), USB_OTG_FS (U11.5), LCD&Camera&Connectors (L5.1 L8.1)
D5V: ExtensionConnector (CN5.49 CN6.49), Power (JP20.7), ST_LINK_V2-1 (D6.1)
E5V: Power (C57.1 JP20.9 L3.3), ST_LINK_V2-1 (D11.1)
GND: Audio (46 pins), CAN&QSPI (12 pins), Ethernet (20 pins), ExtensionConnector (22 pins), JTAG&Trace (24 pins), Memory (40 pins), MotorControl (27 pins), Peripherals (18 pins), Power (18 pins), ST_LINK_V2-1 (40 pins), USB_OTG (39 pins), USB_OTG_FS (13 pins), RS232 (8 pins), LCD&Camera&Connectors (49 pins), MFX & LEDs (16 pins), MCU (70 pins)
U5V_ST_LINK: Power (JP20.11), ST_LINK_V2-1 (C54.2 SB33.2 U17.6 U17.7)
VBUS_FS1: ExtensionConnector (CN6.54), Power (JP20.3), ST_LINK_V2-1 (D9.1), USB_OTG_FS (5 pins), MCU (R265.2)
VBUS_FS2: Power (JP20.5), ST_LINK_V2-1 (D10.1), USB_OTG (CN14.1 D7.6 R136.1 SB22.1), MCU (R263.1)
VBUS_HS: Power (JP20.1), ST_LINK_V2-1 (D8.1), USB_OTG (CN8.1 D3.A1 L2.2)
VDD_MCU: Power (JP2.2), MCU (41 pins)
A0: ExtensionConnector (CN11.14), Memory (U9.E2 U15.G8 U16.A3), MCU (R247.2)
A1: ExtensionConnector (CN11.12), Memory (U9.D2 U15.G9 U16.A4), MCU (R244.2)
A2: ExtensionConnector (CN11.8), Memory (U9.C2 U15.F7 U16.A5), MCU (R243.2)
A3: ExtensionConnector (CN11.5), Memory (U9.A2 U15.F3 U16.B3), MCU (R240.2)
A4: ExtensionConnector (CN11.3), Memory (U9.B2 U15.G1 U16.B4), MCU (R238.2)
A5: ExtensionConnector (CN11.1), Memory (U9.D3 U15.G2 U16.C3), MCU (R237.2)
A6: ExtensionConnector (CN10.5), Memory (U9.C3 U15.G3 U16.C4), MCU (R259.2)
A7: ExtensionConnector (CN10.3), Memory (U9.A3 U15.H1 U16.D4), MCU (R257.2)
A8: ExtensionConnector (CN10.4), Memory (U9.B6 U15.H2 U16.H2), MCU (R260.2)
A9: ExtensionConnector (CN10.18), Memory (U9.A6 U15.J3 U16.H3), MCU (R271.2)
A10: ExtensionConnector (CN10.6), Memory (U9.C6 U15.G7 U16.H4), MCU (R262.2)
A11: ExtensionConnector (CN10.7), Memory (U9.D6 U15.H9 U16.H5), MCU (R261.2)
A12: ExtensionConnector (CN10.33), Memory (U9.B7 U16.G3), MCU (R279.2)
A13: ExtensionConnector (CN10.34), Memory (U9.A7 U16.G4), MCU (R267.2)
A14: ExtensionConnector (CN10.28), Memory (U9.C7 U15.J7 U16.F3), MCU (R280.2)
A15: ExtensionConnector (CN10.25), Memory (U9.D7 U15.H8 U16.F4), MCU (R269.2)
A16: ExtensionConnector (CN10.21), Memory (U9.E7 U16.E4), MCU (R270.1)
A17: ExtensionConnector (CN10.23), Memory (U9.B3 U16.D3), MCU (R281.2)
A18: ExtensionConnector (CN10.31), Memory (U9.C4 U16.H1), MCU (R268.2)
A19: ExtensionConnector (CN11.13), Memory (U9.D5 U16.G2), MCU (R37.2 R38.2)
A20: ExtensionConnector (CN11.11), Memory (U9.D4 U16.H6), MCU (R35.2 R36.2)
A21: ExtensionConnector (CN11.4), Memory (U9.C5), MCU (R21.2 R31.2)
A22: ExtensionConnector (CN11.7), Memory (U9.B8), MCU (R32.2 R34.2)
A23: ExtensionConnector (CN11.16), Memory (U9.C8), MCU (R39.2 R40.2)
D0: ExtensionConnector (CN10.39), Memory (U9.E3 U15.R8 U16.B6), MCU (R278.2)
D1: ExtensionConnector (CN10.38), Memory (U9.H3 U15.N7 U16.C5), MCU (R266.2)
D1_N: ExtensionConnector (CN5.35), USB_OTG (CN14.2 D7.4), MCU (U4.R14)
D1_P: ExtensionConnector (CN5.38), USB_OTG (CN14.3 D7.3), MCU (U4.R15)
D2: ExtensionConnector (CN11.31), Memory (U9.E4 U15.R9 U16.C6), MCU (R272.2)
D2_N: ExtensionConnector (CN6.41), USB_OTG_FS (CN13.2 D5.4), MCU (JP14.1 SB64.2 U4.C15)
D2_P: USB_OTG_FS (CN13.3 D5.3), MCU (SB66.1)
D3: ExtensionConnector (CN11.32), Memory (U9.H4 U15.N8 U16.D5), MCU (R283.2)
D4: ExtensionConnector (CN10.11), Memory (U9.H5 U15.P9 U16.E5), MCU (R62.2)
D5: ExtensionConnector (CN10.14), Memory (U9.E5 U15.M8 U16.F5), MCU (R54.2)
D6: ExtensionConnector (CN10.12), Memory (U9.H6 U15.M7 U16.F6), MCU (R53.2)
D7: ExtensionConnector (CN10.13), Memory (U9.E6 U15.L8 U16.G6), MCU (R63.2)
D8: ExtensionConnector (CN10.16), Memory (U9.F3 U15.L2 U16.B1), MCU (R55.2)
D9: ExtensionConnector (CN10.15), Memory (U9.G3 U15.M3 U16.C1), MCU (R64.2)
D10: ExtensionConnector (CN10.19), Memory (U9.F4 U15.M2 U16.C2), MCU (R66.2)
D11: ExtensionConnector (CN10.20), Memory (U9.G4 U15.P1 U16.D2), MCU (R56.2)
D12: ExtensionConnector (CN10.17), Memory (U9.F5 U15.N2 U16.E2), MCU (R65.2)
D13: ExtensionConnector (CN10.35), Memory (U9.G6 U15.R1 U16.F2), MCU (R60.2)
D14: ExtensionConnector (CN10.37), Memory (U9.F6 U15.N3 U16.F1), MCU (R69.2)
D15: ExtensionConnector (CN10.36), Memory (U9.G7 U15.R2 U16.G1), MCU (R70.2)
D16: ExtensionConnector (CN10.22), Memory (U15.E8), MCU (R57.1)
D17: ExtensionConnector (CN10.26), Memory (U15.D7), MCU (R58.1)
D18: ExtensionConnector (CN10.24), Memory (U15.D8), MCU (R67.1)
D19: ExtensionConnector (CN10.27), Memory (U15.B9), MCU (R68.1)
D20: ExtensionConnector (CN10.32), Memory (U15.C8), MCU (R59.1)
D21: ExtensionConnector (CN11.39), Memory (U15.A9), MCU (R276.1)
D22: ExtensionConnector (CN11.38), Memory (U15.C7), MCU (R286.1)
D23: ExtensionConnector (CN11.36), Memory (U15.A8), MCU (R285.1)
D24: ExtensionConnector (CN11.37), Memory (U15.A2), MCU (R275.1)
D25: ExtensionConnector (CN11.35), Memory (U15.C3), MCU (R274.1)
D26: ExtensionConnector (CN11.33), Memory (U15.A1), MCU (R273.1)
D27: ExtensionConnector (CN11.34), Memory (U15.C2), MCU (R284.1)
D28: ExtensionConnector (CN11.22), Memory (U15.B1), MCU (R254.1)
D29: ExtensionConnector (CN11.18), Memory (U15.D2), MCU (R250.1)
D30: ExtensionConnector (CN11.20), Memory (U15.D3), MCU (R251.1)
D31: ExtensionConnector (CN11.21), Memory (U15.E2), MCU (R252.1)
DSI_CK_N: LCD&Camera&Connectors (CN15.5), MCU (U4.H13)
DSI_CK_P: LCD&Camera&Connectors (CN15.3), MCU (U4.H12)
DSI_D0_N: LCD&Camera&Connectors (CN15.11), MCU (U4.J13)
DSI_D0_P: LCD&Camera&Connectors (CN15.9), MCU (U4.J12)
DSI_D1_N: LCD&Camera&Connectors (CN15.17), MCU (U4.F13)
DSI_D1_P: LCD&Camera&Connectors (CN15.15), MCU (U4.F12)
DSI_RESET: ExtensionConnector (CN6.8), LCD&Camera&Connectors (CN15.57 R162.2 R290.1), MCU (U4.C4)
DSI_TE: ExtensionConnector (CN5.56), LCD&Camera&Connectors (CN15.49 CN18.9), MCU (U4.P7)
I2C1_SCL: MB1219 (R160.2), Audio (R175.1), ExtensionConnector (CN6.31), LCD&Camera&Connectors (5 pins), MFX & LEDs (R293.1), MCU (U4.A7)
I2C1_SDA: MB1219 (R161.2), Audio (R174.1), ExtensionConnector (CN6.14), LCD&Camera&Connectors (5 pins), MFX & LEDs (R294.1), MCU (U4.B4)
LCD_B0: Ethernet (JP4.1), ExtensionConnector (CN6.27), LCD&Camera&Connectors (CN18.21), MCU (U4.B10)
LCD_B1: Ethernet (JP8.3), ExtensionConnector (CN6.26), LCD&Camera&Connectors (CN18.23), MCU (U4.B9)
LCD_B2: ExtensionConnector (CN6.20), LCD&Camera&Connectors (CN18.25), MCU (U4.C9)
LCD_B3: ExtensionConnector (CN6.22), LCD&Camera&Connectors (CN18.27), MCU (U4.D10)
LCD_B4: ExtensionConnector (CN6.16), LCD&Camera&Connectors (CN18.29), MCU (U4.D8)
LCD_B5: ExtensionConnector (CN6.13), LCD&Camera&Connectors (CN18.31), MCU (U4.D7)
LCD_B6: ExtensionConnector (CN6.12), LCD&Camera&Connectors (CN18.33), MCU (U4.C6)
LCD_B7: ExtensionConnector (CN6.11), LCD&Camera&Connectors (CN18.35), MCU (U4.C5)
LCD_BL_CTRL: LCD&Camera&Connectors (CN15.53 CN18.43), MCU (SB74.1)
LCD_G0: LCD&Camera&Connectors (CN18.4), MCU (SB8.1)
LCD_G1: LCD&Camera&Connectors (CN18.6), MCU (SB28.1)
LCD_G2: ExtensionConnector (CN5.20), MotorControl (R14.2), LCD&Camera&Connectors (CN18.8), MCU (SB3.2 U4.P3)
LCD_G3: ExtensionConnector (CN6.46), LCD&Camera&Connectors (CN4.26 CN18.10), MCU (R264.2 U4.F14)
LCD_G4: LCD&Camera&Connectors (CN18.12), MCU (SB63.1)
LCD_G5: LCD&Camera&Connectors (CN18.14), MCU (SB61.1)
LCD_G6: ExtensionConnector (CN5.2), USB_OTG (R122.2), LCD&Camera&Connectors (CN18.16), MCU (U4.F3)
LCD_G7: LCD&Camera&Connectors (CN18.18), MCU (SB5.1)
LCD_INT: LCD&Camera&Connectors (CN15.4 CN18.39), MFX & LEDs (U22.27)
LCD_R0: ExtensionConnector (CN6.5), LCD&Camera&Connectors (CN18.3), MCU (SB4.1 U4.G4)
LCD_R1: ExtensionConnector (CN5.54), LCD&Camera&Connectors (CN18.5), MCU (SB13.1 U4.R6)
LCD_R2: ExtensionConnector (CN5.58), LCD&Camera&Connectors (CN18.7), MCU (SB15.1 U4.R7)
LCD_R4: ExtensionConnector (CN5.31), LCD&Camera&Connectors (CN18.11), MCU (SB59.1 U4.N8)
LCD_R5: ExtensionConnector (CN5.34), LCD&Camera&Connectors (CN18.13), MCU (U4.M9)
LCD_R6: ExtensionConnector (CN5.42), LCD&Camera&Connectors (CN18.15), MCU (U4.M14)
LCD_R7: ExtensionConnector (CN5.51 CN11.27), LCD&Camera&Connectors (CN18.17), MCU (SB20.1 U4.J15)
NetB3_1: Peripherals (B3.1 C92.2 R197.2), MFX & LEDs (U22.20)
NetB3_2: Peripherals (B3.2 C91.2 R196.2), MFX & LEDs (U22.18)
NetB3_3: Peripherals (B3.3 C90.2 R195.2), MFX & LEDs (U22.19)
NetB3_4: Peripherals (B3.4 C94.2 R199.2), MFX & LEDs (U22.39)
NetB3_6: Peripherals (B3.6 C93.2 R198.2), MFX & LEDs (U22.40)
NetC6_2: MotorControl (C6.2 CN1.31 SB2.2), MCU (SB45.1)
NetC7_2: MotorControl (C7.2 CN1.27 SB1.2), MCU (SB60.1)
NetC8_2: MotorControl (C8.2 CN1.33), MCU (SB34.1)
NetC9_2: MotorControl (C9.2 CN1.34), MCU (SB37.1)
NetC10_2: MotorControl (C10.2 CN1.29), MCU (SB64.1)
NetC11_1: MotorControl (C11.1 R7.2), MCU (SB67.2)
NetC12_2: MotorControl (C12.2 R8.1), MCU (SB56.2)
NetC13_2: MotorControl (C13.2 R9.1), MCU (SB49.2)
NetC14_2: MotorControl (C14.2 R10.1), MCU (SB42.2)
NetC15_1: MotorControl (C15.1 R11.2 R12.1), MCU (SB51.2)
NetC18_2: MotorControl (C18.2 SB1.1), MCU (SB70.1)
NetCN1_3: MotorControl (CN1.3), MCU (SB18.2)
NetCN1_5: MotorControl (CN1.5), MCU (SB46.1)
NetCN1_9: MotorControl (CN1.9), MCU (SB73.1)
NetCN1_11: MotorControl (CN1.11), MCU (SB72.2)
NetCN1_13: MotorControl (CN1.13), MCU (SB50.1)
NetCN1_21: MotorControl (CN1.21), MCU (SB57.2)
NetCN1_23: MotorControl (CN1.23), MCU (SB53.2)
NetCN4_15: LCD&Camera&Connectors (CN4.15 R233.2), MFX & LEDs (U22.33)
NetCN4_17: LCD&Camera&Connectors (CN4.17 R236.1), MFX & LEDs (U22.32)
NetCN4_19: LCD&Camera&Connectors (CN4.19 R239.1), MFX & LEDs (U22.10)
NetCN4_33: LCD&Camera&Connectors (CN4.33), MCU (SB3.1)
NetCN11_6: ExtensionConnector (CN11.6), Memory (R90.1 U9.A4), MCU (JP9.2)
NetCN12_12: JTAG&Trace (CN12.12 U12.1), MCU (SB10.1)
NetCN12_14: JTAG&Trace (CN12.14 R109.1 U10.5), MCU (SB11.1)
NetCN12_16: JTAG&Trace (CN12.16 R111.1 U10.4), MCU (SB9.1)
NetCN12_18: JTAG&Trace (CN12.18 U10.3), MCU (SB6.1)
NetCN12_20: JTAG&Trace (CN12.20 U10.1), MCU (SB26.1)
NetCN14_4: USB_OTG (CN14.4 D7.1), MCU (SB65.1)
NetCN15_35: Audio (U20.G1), LCD&Camera&Connectors (CN15.35), MCU (JP3.1)
NetCN15_39: Audio (U20.E4), LCD&Camera&Connectors (CN15.39), MCU (SB43.1)
NetCN15_45: Ethernet (JP12.3), LCD&Camera&Connectors (CN15.45), MCU (SB71.1)
NetCN15_47: LCD&Camera&Connectors (CN15.47), MCU (SB14.1)
NetCN17_1: Peripherals (CN17.1 R158.2), MCU (R287.1)
NetCN17_2: Peripherals (CN17.2 R157.2), MCU (R282.1)
NetCN17_3: Peripherals (CN17.3 R156.2), MCU (SB76.1)
NetCN17_7: Peripherals (CN17.7 R154.2), MCU (SB75.2)
NetCN17_8: Peripherals (CN17.8 R153.2), MCU (R264.1)
NetCN30_5: Peripherals (CN30.5), MCU (JP7.1)
NetD1_1: RS232 (U5.20), MCU (D1.1)
NetJP3_3: Ethernet (JP4.3), MCU (JP3.3)
NetJP5_2: RS232 (U5.16), MCU (JP5.2)
NetJP6_1: Audio (U20.F2), MCU (JP6.1)
NetJP6_3: Ethernet (JP8.1), MCU (JP6.3)
NetJP7_3: Audio (JP23.3), MCU (JP7.3)
NetJP10_2: Memory (R89.2), MCU (JP10.2)
NetJP11_1: MB1219 (JP21.1), RS232 (JP11.1)
NetJP13_3: ExtensionConnector (JP13.3), MCU (SB19.2)
NetJP14_2: CAN&QSPI (U23.4), MCU (JP14.2)
NetJP17_3: ExtensionConnector (JP17.3), MCU (SB17.2)
NetJP24_3: Audio (JP24.3), MCU (R246.1)
NetJP26_1: MB1219 (JP26.1), RS232 (U5.13)
NetJP26_2: MB1219 (JP26.2), MCU (SB68.1)
NetR42_1: Ethernet (U6.6), MCU (R42.1)
NetR47_2: Ethernet (R47.2), MCU (SB55.2)
NetR48_2: Ethernet (R48.2), MCU (SB69.2)
NetR49_2: Ethernet (R49.2), MCU (SB54.2)
NetR50_2: Ethernet (R50.2), MCU (SB48.1)
NetR51_2: Ethernet (R51.2), MCU (SB36.1)
NetR61_2: Ethernet (R61.2), MCU (SB52.2)
NetR72_2: Ethernet (R72.2 U6.7), MFX & LEDs (U22.26)
NetR119_1: USB_OTG (R119.1), MFX & LEDs (U22.29)
NetR130_2: USB_OTG_FS (R130.2), MFX & LEDs (U22.17)
NetR132_1: USB_OTG_FS (R132.1), MFX & LEDs (U22.16)
NetR146_2: Memory (R146.2), MCU (SB20.2)
NetR150_1: Peripherals (R150.1 R151.1), MFX & LEDs (U22.28)
NetR200_1: Peripherals (R200.1 R224.1), MFX & LEDs (U22.31)
NetR213_1: MFX & LEDs (R213.1), MCU (SB59.2)
NetR214_1: MFX & LEDs (R214.1), MCU (SB15.2)
NetR215_1: MFX & LEDs (R215.1), MCU (SB13.2)
NetR216_1: MFX & LEDs (R216.1), MCU (SB4.2)
NetR245_2: Ethernet (U6.5), MCU (R245.2)
NetR248_2: Ethernet (U6.3), MCU (R248.2)
NetR249_2: Ethernet (U6.4), MCU (R249.2)
NetR256_2: Ethernet (U6.2), MCU (R256.2)
NetSB12_2: Ethernet (U6.41), MCU (SB12.2)
NetSB23_1: USB_OTG (SB23.1), MFX & LEDs (U22.30)
NetSB27_1: Audio (U20.D3), MCU (SB27.1)
NetSB47_1: Ethernet (U6.40), MCU (SB47.1)
NetSB58_2: Ethernet (U6.42), MCU (SB58.2)
NetSB62_1: CAN&QSPI (U23.1), MCU (SB62.1)
NetU20_G3: Audio (U20.G3), MFX & LEDs (U22.15)
PA0: ExtensionConnector (CN5.15), MCU (SB43.2 SB45.2 SB47.2 U4.N3)
PA1: ExtensionConnector (CN5.14), MCU (SB34.2 SB36.2 U4.N2)
PA2: ExtensionConnector (CN5.13), MCU (SB35.2 SB37.2 U4.P2)
PA3: ExtensionConnector (CN5.18), USB_OTG (R86.2), MCU (U4.R2)
PA4: ExtensionConnector (CN5.21), LCD&Camera&Connectors (CN4.31), MCU (U4.N4)
PA5: ExtensionConnector (CN5.24), USB_OTG (R124.2), MCU (U4.P4)
PA7: ExtensionConnector (CN5.22), MCU (SB46.2 SB48.2 U4.R3)
PA8: ExtensionConnector (CN6.52), MCU (SB70.2 SB71.2 SB74.2 U4.F15)
PA9: ExtensionConnector (CN6.43), MCU (R265.1 SB68.2 U4.E15)
PA10: MB1219 (JP21.2), ExtensionConnector (CN6.44), USB_OTG_FS (R115.2), MCU (U4.D15)
PA12: ExtensionConnector (CN6.42), MCU (SB60.2 SB62.2 SB66.2 U4.B15)
PA13: ExtensionConnector (CN6.40), JTAG&Trace (R84.2), ST_LINK_V2-1 (U21.25 U21.27), MCU (U4.A15)
PA14: ExtensionConnector (CN6.36), JTAG&Trace (R91.2), ST_LINK_V2-1 (U21.15 U21.26), MCU (U4.A14)
PA15: ExtensionConnector (CN6.32), JTAG&Trace (R99.2), ST_LINK_V2-1 (U21.17), MCU (U4.A13)
PAR_D0: ExtensionConnector (CN6.58), LCD&Camera&Connectors (CN4.23), MCU (JP9.1 SB18.1 U4.H15)
PAR_D1: ExtensionConnector (CN11.24), MotorControl (CN1.7), LCD&Camera&Connectors (CN4.24), MCU (JP10.1 U4.G15)
PAR_D2: ExtensionConnector (CN6.51), LCD&Camera&Connectors (CN4.25), MCU (SB17.1 SB72.1 SB75.1 U4.G14)
PAR_D4: ExtensionConnector (CN6.53), LCD&Camera&Connectors (CN4.27), MCU (R282.2 U4.B13)
PAR_D5: ExtensionConnector (CN6.23), LCD&Camera&Connectors (CN4.28), MCU (R246.2 U4.C11)
PAR_D6: LCD&Camera&Connectors (CN4.29), MCU (SB7.1)
PAR_D7: LCD&Camera&Connectors (CN4.30), MCU (SB25.1)
PAR_D8: ExtensionConnector (CN6.55), LCD&Camera&Connectors (CN4.9 R16.2), MCU (R287.2 U4.B14)
PAR_D9: ExtensionConnector (CN6.28), Peripherals (CN17.5), LCD&Camera&Connectors (CN4.10), MCU (U4.A12)
PAR_D10: ExtensionConnector (CN6.47), LCD&Camera&Connectors (CN4.5), MCU (JP7.2 U4.B11)
PAR_D11: ExtensionConnector (CN6.57), LCD&Camera&Connectors (CN4.6), MCU (SB76.2 U4.D12)
PB0: ExtensionConnector (CN5.52), USB_OTG (R93.2), MCU (SB73.2 U4.R5)
PB1: ExtensionConnector (CN5.26), USB_OTG (R98.2), MCU (SB50.2 U4.R4)
PB2: CAN&QSPI (U3.16), ExtensionConnector (CN5.29), MCU (R43.2)
PB3: ExtensionConnector (CN6.45), JTAG&Trace (R97.2), Peripherals (CN30.1 R205.2), ST_LINK_V2-1 (U21.16 U21.31), MCU (U4.A10)
PB4: ExtensionConnector (CN6.24), Peripherals (CN30.2 R204.2), MCU (SB16.2 U4.A9)
PB5: ExtensionConnector (CN5.4), USB_OTG (R117.2), MCU (SB5.2 U4.A8)
PB6: CAN&QSPI (R230.2 U3.7), ExtensionConnector (CN6.18), MCU (R44.2)
PB7: ExtensionConnector (CN6.21), LCD&Camera&Connectors (CN4.32), MCU (U4.B5)
PB10: ExtensionConnector (CN5.33), USB_OTG (R100.2), MCU (SB63.2 U4.P12)
PB11: ExtensionConnector (CN5.36), USB_OTG (R104.2), MCU (SB61.2 U4.R13)
PB12: ExtensionConnector (CN5.41), USB_OTG (R107.2), MCU (SB65.2 U4.L13)
PB13: ExtensionConnector (CN5.43), USB_OTG (R113.2), MCU (R263.2 U4.K14)
PC0: ExtensionConnector (CN5.11), USB_OTG (R123.2), MCU (U4.M2)
PC1: ExtensionConnector (CN5.16), MCU (SB42.1 SB44.1 U4.M3)
PC2: ExtensionConnector (CN5.23), MCU (R245.1 SB49.1 U4.M4)
PC3: ExtensionConnector (CN5.27), MCU (SB52.1 SB56.1 U4.L4)
PC4: ExtensionConnector (CN5.25), MCU (SB51.1 SB54.1 U4.N5)
PC5: ExtensionConnector (CN5.46), MCU (SB67.1 SB69.1 U4.P5)
PC13: ExtensionConnector (CN6.6), MFX & LEDs (R182.2), MCU (R217.2 U4.D1)
PC14: ExtensionConnector (SB38.1), MCU (R23.2 U4.E1)
PC15: ExtensionConnector (SB39.1), MCU (R22.2 U4.F1)
PD4: ExtensionConnector (CN11.28), Memory (U9.G2 U16.A2), MCU (U4.D11)
PD5: ExtensionConnector (CN11.26), Memory (R105.2), MCU (U4.C10)
PD7: ExtensionConnector (CN6.56), Peripherals (CN30.3 R203.2), MCU (U4.A11)
PE0: ExtensionConnector (CN11.25), Memory (U15.K9 U16.A1), MCU (U4.A6)
PE1: ExtensionConnector (CN11.23), Memory (U15.K1 U16.B2), MCU (U4.A5)
PF6: CAN&QSPI (R241.2), ExtensionConnector (CN5.7), MCU (R24.2)
PF7: CAN&QSPI (R232.1), ExtensionConnector (CN5.8), MCU (R19.2)
PF8: CAN&QSPI (R242.1), ExtensionConnector (CN5.17), MCU (R41.2)
PF9: CAN&QSPI (R231.2), ExtensionConnector (CN5.12), MCU (R26.2)
PF10: ExtensionConnector (CN5.9), Peripherals (R30.2), MCU (U4.L1)
PF11: ExtensionConnector (CN10.8), Memory (U15.J9), MCU (R52.2)
PG7: ExtensionConnector (CN5.47), MCU (SB19.1 U4.J14)
PG8: ExtensionConnector (CN10.40), Memory (U15.J1), MCU (R277.2)
PG9: Audio (R172.2), ExtensionConnector (CN6.17), Peripherals (CN30.7 R202.2), LCD&Camera&Connectors (CN15.37), MCU (U4.D9)
PG10: Peripherals (CN30.8 R201.2), MCU (U4.C8)
PG11: ExtensionConnector (CN6.33), MCU (R256.1 SB57.1 U4.B8)
PG12: Audio (R206.1), ExtensionConnector (CN6.15), MCU (U4.C7)
PG13: ExtensionConnector (CN6.25), MCU (R248.1 U4.B3)
PG14: ExtensionConnector (CN6.29), MCU (R249.1 U4.A4)
PG15: ExtensionConnector (CN11.19), Memory (U15.K7), MCU (R45.2)
PH0: ExtensionConnector (SB40.1), MCU (C23.1 U4.G1 X1.1)
PH1: ExtensionConnector (SB41.1), MCU (R20.1 U4.H1)
PH2: ExtensionConnector (CN11.2), Memory (R291.2), MCU (U4.K4)
PH3: ExtensionConnector (CN10.1), Memory (U15.J8), MCU (R255.1)
PH4: ExtensionConnector (CN5.28), USB_OTG (R121.2), MCU (U4.H4)
PH5: ExtensionConnector (CN10.2), Memory (U15.K8), MCU (R258.1)
PH6: ExtensionConnector (CN5.37), MCU (SB53.1 SB55.1 U4.P13)
PH7: Ethernet (R46.2), ExtensionConnector (CN5.40), MCU (U4.N13)
PI4: ExtensionConnector (CN11.17), Memory (U15.F8), MCU (U4.C3)
PI5: ExtensionConnector (CN11.15), Memory (U15.F2), MCU (U4.D3)
PI8: ExtensionConnector (CN6.9), MFX & LEDs (R296.1), MCU (U4.C2)
PI12: ExtensionConnector (CN6.7), LCD&Camera&Connectors (CN18.26), MCU (U4.E3)
PI13: ExtensionConnector (CN6.2), LCD&Camera&Connectors (CN18.28), MCU (U4.G3)
PI14: ExtensionConnector (CN5.32), LCD&Camera&Connectors (CN18.32), MCU (R228.1)
RESET#: Ethernet (U6.29), ExtensionConnector (R226.1), JTAG&Trace (R102.2), ST_LINK_V2-1 (U21.18), USB_OTG (R125.2), LCD&Camera&Connectors (CN18.36), MFX & LEDs (D14.2), MCU (5 pins)
STLINK_RX: MB1219 (JP26.3), ST_LINK_V2-1 (CN23.1 U21.13)
STLINK_TX: MB1219 (JP21.3), ST_LINK_V2-1 (CN23.2 U21.12)
T_JRST: JTAG&Trace (R110.2), ST_LINK_V2-1 (U21.19), MCU (SB16.1)